# EAGLE schematic SparkFun-MicroViewUSB (EAGLE 6.5.0)
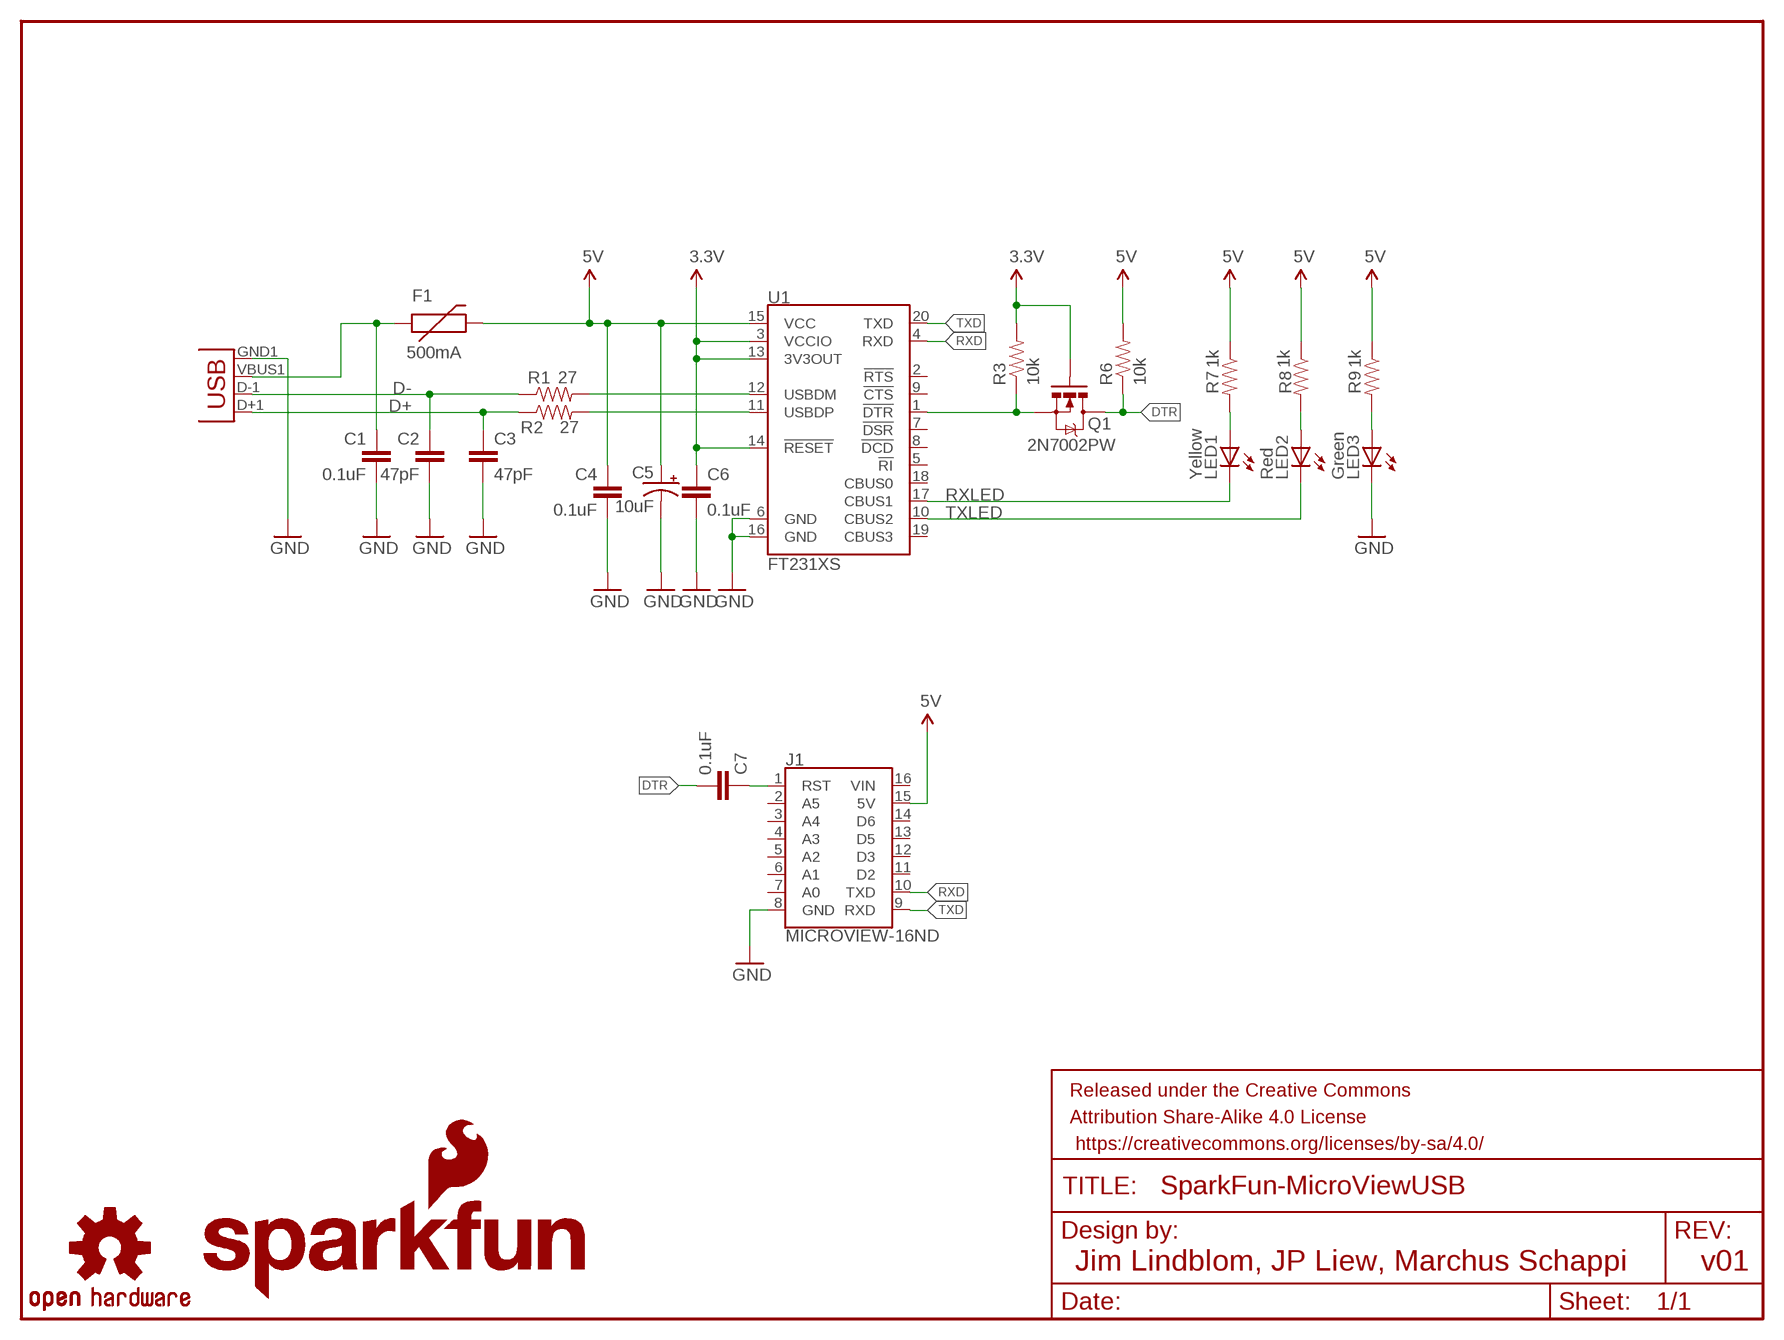
[diagram p0: schematic, sheet 1]

## Parts
C1  0.1uF  CAP0603-CAP  [0603-CAP]
C2  47pF  47PF-50V-5%(0603)  [0603-CAP]
C3  47pF  47PF-50V-5%(0603)  [0603-CAP]
C4  0.1uF  CAP0603-CAP  [0603-CAP]
C5  10uF  CAP_POL1206  [EIA3216]
C6  0.1uF  CAP0603-CAP  [0603-CAP]
C7  0.1uF  0.1UF-25V(+80/-20%)(0603)  [0603-CAP]
F1  500mA  PTCSMD  [PTC-1206]
FRAME1  FRAME-LETTER  [CREATIVE_COMMONS]
J1  MICROVIEW-16ND  [MV-DIP16-NODIMENSION]
JP2  USBA-SMD-MALE  [USB-A-SMT-MALE]
LED1  Yellow  LED1206  [LED-1206]
LED2  Red  LED1206  [LED-1206]
LED3  Green  LED1206  [LED-1206]
LOGO1  OSHW-LOGOS  [OSHW-LOGO-S]
LOGO2  SFE_LOGO_FLAME.1_INCH  [SFE_LOGO_FLAME_.1]
LOGO3  SFE_LOGO_NAME_FLAME.1_INCH  [SFE_LOGO_NAME_FLAME_.1]
Q1  2N7002PW  MOSFET-NCHANNEL2N7002PW  [SOT323]
R1  27  RESISTOR0603-RES  [0603-RES]
R2  27  RESISTOR0603-RES  [0603-RES]
R3  10k  RESISTOR0603-RES  [0603-RES]
R6  10k  RESISTOR0603-RES  [0603-RES]
R7  1k  RESISTOR0603-RES  [0603-RES]
R8  1k  RESISTOR0603-RES  [0603-RES]
R9  1k  RESISTOR0603-RES  [0603-RES]
U1  FT231XS  [SSOP20_L]

## Nets
3.3V: C6.1 Q1.1(G) R3.2 U1.3(VCCIO) U1.13(3V3OUT) U1.14(!RESET)
5V: C4.1 C5.A(+) F1.2 J1.15(5V) R6.2 R7.1 R8.1 R9.1 U1.15(VCC)
D+: C3.1 JP2.D+1(D+) R2.1
D-: C2.1 JP2.D-1(D-) R1.1
DTR: C7.2 Q1.3(D) R6.1
GND: C1.2 C2.2 C3.2 C4.2 C5.C(-) C6.2 J1.8(GND) JP2.GND1(GND) LED3.C U1.6(GND) U1.16(GND)
N$1: LED3.A R9.2
N$2: C7.1 J1.1(RST)
N$6: R1.2 U1.12(USBDM)
N$7: R2.2 U1.11(USBDP)
N$8: LED2.A R8.2
N$10: LED1.A R7.2
N$12: Q1.2(S) R3.1 U1.1(!DTR)
RXD: J1.10(TXD) U1.4(RXD)
RXLED: LED1.C U1.17(CBUS1)
TXD: J1.9(RXD) U1.20(TXD)
TXLED: LED2.C U1.10(CBUS2)
VUSB: C1.1 F1.1 JP2.VBUS1(VBUS)
Unconnected: J1.2(A5) J1.3(A4) J1.4(A3) J1.5(A2) J1.6(A1) J1.7(A0) J1.11(D2) J1.12(D3) J1.13(D5) J1.14(D6) J1.16(VIN) U1.2(!RTS) U1.5(!RI) U1.7(!DSR) U1.8(!DCD) U1.9(!CTS) U1.18(CBUS0) U1.19(CBUS3)

## Notes on the sheet
- Jim Lindblom, JP Liew, Marchus Schappi | v01

## Library data of the parts
C1 C4 C6 = SparkFun:CAP: Capacitor Standard 0603 ceramic capacitor, and 0.1" leaded capacitor.
C2 C3 = SparkFun-Capacitors:47PF-50V-5%(0603): CAP-08913; PROD_ID: CAP-08913
C5 = SparkFun-Capacitors:CAP_POL: Capacitor Polarized These are standard SMD and PTH capacitors. Normally 10uF, 47uF, and 100uF in electrolytic and tantalum varieties. Always verify the external diameter of the through hole cap, it varies with capacity, voltage, and manufacturer. The EIA devices should be standard.
C7 = SparkFun-Capacitors:0.1UF-25V(+80/-20%)(0603): CAP-00810 Ceramic Standard decoupling cap; PROD_ID: CAP-00810
F1 = SparkFun:PTC: Resettable Fuse PTC Resettable Fuse. Spark Fun Electronics SKU : COM-08357
FRAME1 = SparkFun-Aesthetics:FRAME-LETTER: Schematic Frame Standard 8.5x11 US Letter frame
J1 = microView-temp:MICROVIEW-16
JP2 = microView-temp:USB: USB Connectors USB-B-PTH is fully proven SKU : PRT-00139/CONN-08278 USB-miniB is fully proven SKU : PRT-00587 USB-A-PCB is untested. USB-A-H is throughly reviewed, but untested. Spark Fun Electronics SKU : PRT-00437 USB-B-SMT is throughly reviewed, but untested. Needs silkscreen touching up. USB-A-S has not been used/tested USB-MB-H has not been used/tested USB-MICROB has been used. CONN-09505
LED1-LED3 = SparkFun-LED:LED: LEDs Standard schematic elements and footprints for 5mm, 3mm, 1206, and 0603 sized LEDs. 5mm - Spark Fun Electronics SKU : COM-00529 (and others)
LOGO1 = SparkFun-Aesthetics:OSHW-LOGO: Open Source Hardware Logo This logo indicates the piece of hardware it is found on incorporates a OSHW license and/or adheres to the definition of open source hardware found here: http://freedomdefined.org/OSHW
LOGO2 = SparkFun-Aesthetics:SFE_LOGO_FLAME: SFE Logo, flame only This is the SparkFun flame logo. The logo on the schematic will always be the same size; the package variant is the height of the flame. Default layer for the logo on the board is tSilk.
LOGO3 = SparkFun-Aesthetics:SFE_LOGO_NAME_FLAME: SFE Logo, name and flame This is the SparkFun full logo. The logo on the schematic will always be the same size; the package variant is the height of the flame part of the logo. Default layer for the logo on the board is tSilk.
Q1 = SparkFun-DiscreteSemi:MOSFET-NCHANNEL: Common NMOSFET Parts MFG P/N Store ID Prod ID FDD8780 TRANS-09984 SI7820DN TRANS-11055 FDS6630A IC-08089 2N7002PW TRANS-11151 FQP30N06L COM-10213 TRANS-10060 BSS123LT1G TRANS-08345 BSS138 TRANS-00830 BS170 2N7000; PROD_ID: TRANS-11151
R1 R2 = SparkFun-Resistors:RESISTOR: Resistor Basic schematic elements and footprints for 0603, 1206, and PTH resistors.
R3 R6-R9 = SparkFun:RESISTOR: Resistor Basic schematic elements and footprints for 0603, 1206, and PTH resistors.
U1 = SparkFun-DigitalIC:FT231X: FTDI FT231X Full Speed USB to Full-handshake UART This USB2.0 Full Speed IC offers a compact bridge to full handshake UART interfaces. The device is a UART, capable of operating up to 3MBaud, with low power consumption (8mA). The FT231X includes the complete FT-X series feature set and enables USB to be added into a system design quickly and easily over a UART interface.

## Net classes
0 default: width 0.152 mm, drill 0.305 mm, clearance 0.152 mm